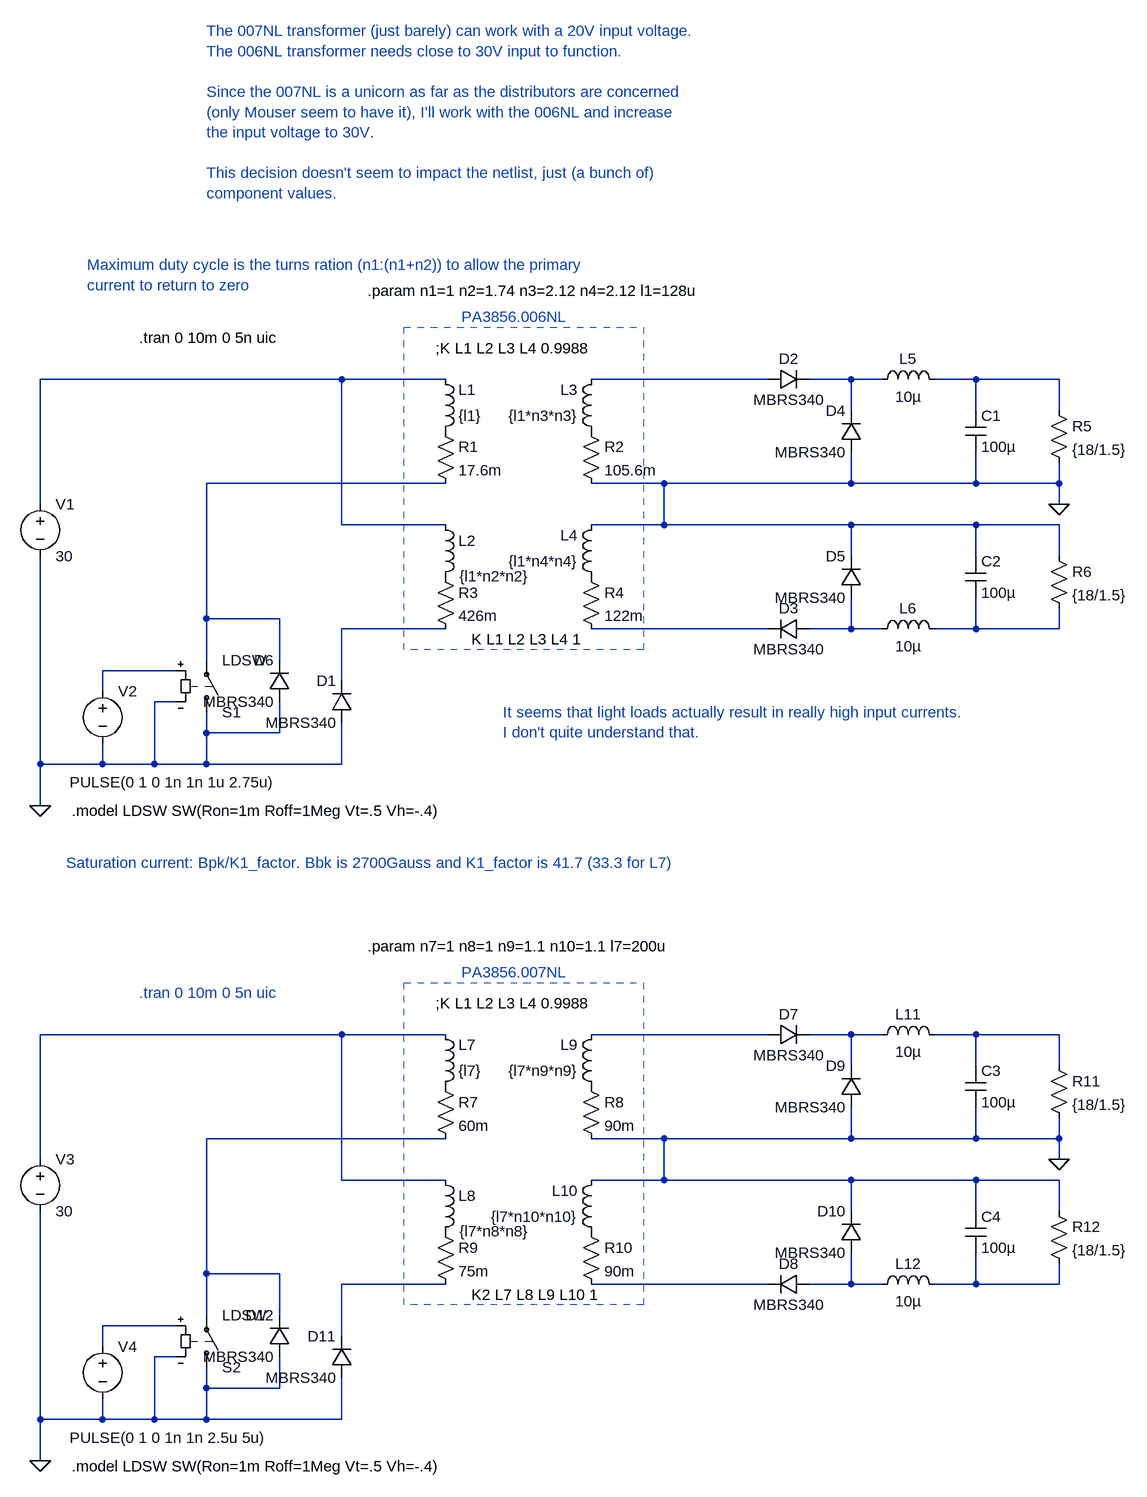
[diagram p0: schematic forward_regulator_test1.asc]
forward_regulator_test1.asc, the LTspice schematic file:
Version 4.1
SHEET 1 1368 2500
WIRE -16 96 -480 96
WIRE 144 96 -16 96
WIRE 640 96 368 96
WIRE 768 96 704 96
WIRE 816 96 768 96
WIRE 960 96 896 96
WIRE 1088 96 960 96
WIRE 768 144 768 96
WIRE 960 144 960 96
WIRE 1088 144 1088 96
WIRE 144 256 -224 256
WIRE 480 256 368 256
WIRE 768 256 768 208
WIRE 768 256 480 256
WIRE 960 256 960 208
WIRE 960 256 768 256
WIRE 1088 256 1088 224
WIRE 1088 256 960 256
WIRE -480 288 -480 96
WIRE 1088 288 1088 256
WIRE -16 320 -16 96
WIRE 144 320 -16 320
WIRE 480 320 480 256
WIRE 480 320 368 320
WIRE 768 320 480 320
WIRE 960 320 768 320
WIRE 1088 320 960 320
WIRE 768 368 768 320
WIRE 960 368 960 320
WIRE 1088 368 1088 320
WIRE -224 464 -224 256
WIRE -112 464 -224 464
WIRE 144 480 -16 480
WIRE 640 480 368 480
WIRE 768 480 768 432
WIRE 768 480 704 480
WIRE 816 480 768 480
WIRE 960 480 960 432
WIRE 960 480 896 480
WIRE 1088 480 1088 448
WIRE 1088 480 960 480
WIRE -224 528 -224 464
WIRE -112 528 -112 464
WIRE -272 544 -384 544
WIRE -16 560 -16 480
WIRE -384 576 -384 544
WIRE -272 592 -304 592
WIRE -224 640 -224 608
WIRE -112 640 -112 592
WIRE -112 640 -224 640
WIRE -480 688 -480 368
WIRE -384 688 -384 656
WIRE -384 688 -480 688
WIRE -304 688 -304 592
WIRE -304 688 -384 688
WIRE -224 688 -224 640
WIRE -224 688 -304 688
WIRE -16 688 -16 624
WIRE -16 688 -224 688
WIRE -480 752 -480 688
WIRE -16 1104 -480 1104
WIRE 144 1104 -16 1104
WIRE 640 1104 368 1104
WIRE 768 1104 704 1104
WIRE 816 1104 768 1104
WIRE 960 1104 896 1104
WIRE 1088 1104 960 1104
WIRE 768 1152 768 1104
WIRE 960 1152 960 1104
WIRE 1088 1152 1088 1104
WIRE 144 1264 -224 1264
WIRE 480 1264 368 1264
WIRE 768 1264 768 1216
WIRE 768 1264 480 1264
WIRE 960 1264 960 1216
WIRE 960 1264 768 1264
WIRE 1088 1264 1088 1232
WIRE 1088 1264 960 1264
WIRE -480 1296 -480 1104
WIRE 1088 1296 1088 1264
WIRE -16 1328 -16 1104
WIRE 144 1328 -16 1328
WIRE 480 1328 480 1264
WIRE 480 1328 368 1328
WIRE 768 1328 480 1328
WIRE 960 1328 768 1328
WIRE 1088 1328 960 1328
WIRE 768 1376 768 1328
WIRE 960 1376 960 1328
WIRE 1088 1376 1088 1328
WIRE -224 1472 -224 1264
WIRE -112 1472 -224 1472
WIRE 144 1488 -16 1488
WIRE 640 1488 368 1488
WIRE 768 1488 768 1440
WIRE 768 1488 704 1488
WIRE 816 1488 768 1488
WIRE 960 1488 960 1440
WIRE 960 1488 896 1488
WIRE 1088 1488 1088 1456
WIRE 1088 1488 960 1488
WIRE -224 1536 -224 1472
WIRE -112 1536 -112 1472
WIRE -272 1552 -384 1552
WIRE -16 1568 -16 1488
WIRE -384 1584 -384 1552
WIRE -272 1600 -304 1600
WIRE -224 1648 -224 1616
WIRE -112 1648 -112 1600
WIRE -112 1648 -224 1648
WIRE -480 1696 -480 1376
WIRE -384 1696 -384 1664
WIRE -384 1696 -480 1696
WIRE -304 1696 -304 1600
WIRE -304 1696 -384 1696
WIRE -224 1696 -224 1648
WIRE -224 1696 -304 1696
WIRE -16 1696 -16 1632
WIRE -16 1696 -224 1696
WIRE -480 1760 -480 1696
FLAG -480 752 0
FLAG 1088 288 0
FLAG -480 1760 0
FLAG 1088 1296 0
SYMBOL ind 128 192 M180
WINDOW 0 36 80 Left 2
WINDOW 3 36 40 Left 2
SYMATTR InstName L1
SYMATTR Value {l1}
SYMATTR Type ind
SYMATTR SpiceLine Rser=1m
SYMBOL ind 128 304 R0
WINDOW 3 37 95 Left 2
SYMATTR InstName L2
SYMATTR Value {l1*n2*n2}
SYMATTR Type ind
SYMATTR SpiceLine Rser=1m
SYMBOL ind 384 192 R180
WINDOW 0 36 80 Left 2
WINDOW 3 36 40 Left 2
SYMATTR InstName L3
SYMATTR Value {l1*n3*n3}
SYMATTR Type ind
SYMATTR SpiceLine Rser=1m
SYMBOL ind 384 416 R180
WINDOW 0 36 80 Left 2
WINDOW 3 36 40 Left 2
SYMATTR InstName L4
SYMATTR Value {l1*n4*n4}
SYMATTR Type ind
SYMATTR SpiceLine Rser=1m
SYMBOL res 128 160 R0
SYMATTR InstName R1
SYMATTR Value 17.6m
SYMBOL res 352 160 R0
SYMATTR InstName R2
SYMATTR Value 105.6m
SYMBOL res 128 384 R0
SYMATTR InstName R3
SYMATTR Value 426m
SYMBOL res 352 384 R0
SYMATTR InstName R4
SYMATTR Value 122m
SYMBOL voltage -480 272 R0
SYMATTR InstName V1
SYMATTR Value 30
SYMBOL sw -224 624 M180
SYMATTR InstName S1
SYMATTR Value LDSW
SYMBOL diode 640 112 R270
WINDOW 0 32 32 VTop 2
WINDOW 3 0 32 VBottom 2
SYMATTR InstName D2
SYMATTR Value MBRS340
SYMBOL ind 800 112 R270
WINDOW 0 32 56 VTop 2
WINDOW 3 5 56 VBottom 2
SYMATTR InstName L5
SYMATTR Value 10µ
SYMBOL cap 944 144 R0
SYMATTR InstName C1
SYMATTR Value 100µ
SYMBOL res 1072 128 R0
SYMATTR InstName R5
SYMATTR Value {18/1.5}
SYMBOL ind 800 496 R270
WINDOW 0 32 56 VTop 2
WINDOW 3 5 56 VBottom 2
SYMATTR InstName L6
SYMATTR Value 10µ
SYMBOL cap 944 368 R0
SYMATTR InstName C2
SYMATTR Value 100µ
SYMBOL res 1072 352 R0
SYMATTR InstName R6
SYMATTR Value {18/1.5}
SYMBOL diode 704 464 R90
WINDOW 0 0 32 VBottom 2
WINDOW 3 32 32 VTop 2
SYMATTR InstName D3
SYMATTR Value MBRS340
SYMBOL diode 784 208 R180
WINDOW 0 24 64 Left 2
WINDOW 3 24 0 Left 2
SYMATTR InstName D4
SYMATTR Value MBRS340
SYMBOL diode 784 432 R180
WINDOW 0 24 64 Left 2
WINDOW 3 24 0 Left 2
SYMATTR InstName D5
SYMATTR Value MBRS340
SYMBOL diode 0 624 R180
WINDOW 0 24 64 Left 2
WINDOW 3 24 0 Left 2
SYMATTR InstName D1
SYMATTR Value MBRS340
SYMBOL voltage -384 560 R0
WINDOW 3 -51 156 Left 2
WINDOW 123 0 0 Left 0
WINDOW 39 0 0 Left 0
SYMATTR Value PULSE(0 1 0 1n 1n 1u 2.75u)
SYMATTR InstName V2
SYMBOL diode -96 592 R180
WINDOW 0 24 64 Left 2
WINDOW 3 24 0 Left 2
SYMATTR InstName D6
SYMATTR Value MBRS340
SYMBOL ind 128 1200 M180
WINDOW 0 36 80 Left 2
WINDOW 3 36 40 Left 2
SYMATTR InstName L7
SYMATTR Value {l7}
SYMATTR Type ind
SYMATTR SpiceLine Rser=1m
SYMBOL ind 128 1312 R0
WINDOW 3 37 95 Left 2
SYMATTR InstName L8
SYMATTR Value {l7*n8*n8}
SYMATTR Type ind
SYMATTR SpiceLine Rser=1m
SYMBOL ind 384 1200 R180
WINDOW 0 36 80 Left 2
WINDOW 3 36 40 Left 2
SYMATTR InstName L9
SYMATTR Value {l7*n9*n9}
SYMATTR Type ind
SYMATTR SpiceLine Rser=1m
SYMBOL ind 384 1424 R180
WINDOW 0 36 80 Left 2
WINDOW 3 36 40 Left 2
SYMATTR InstName L10
SYMATTR Value {l7*n10*n10}
SYMATTR Type ind
SYMATTR SpiceLine Rser=1m
SYMBOL res 128 1168 R0
SYMATTR InstName R7
SYMATTR Value 60m
SYMBOL res 352 1168 R0
SYMATTR InstName R8
SYMATTR Value 90m
SYMBOL res 128 1392 R0
SYMATTR InstName R9
SYMATTR Value 75m
SYMBOL res 352 1392 R0
SYMATTR InstName R10
SYMATTR Value 90m
SYMBOL voltage -480 1280 R0
SYMATTR InstName V3
SYMATTR Value 30
SYMBOL sw -224 1632 M180
SYMATTR InstName S2
SYMATTR Value LDSW
SYMBOL diode 640 1120 R270
WINDOW 0 32 32 VTop 2
WINDOW 3 0 32 VBottom 2
SYMATTR InstName D7
SYMATTR Value MBRS340
SYMBOL ind 800 1120 R270
WINDOW 0 32 56 VTop 2
WINDOW 3 5 56 VBottom 2
SYMATTR InstName L11
SYMATTR Value 10µ
SYMBOL cap 944 1152 R0
SYMATTR InstName C3
SYMATTR Value 100µ
SYMBOL res 1072 1136 R0
SYMATTR InstName R11
SYMATTR Value {18/1.5}
SYMBOL ind 800 1504 R270
WINDOW 0 32 56 VTop 2
WINDOW 3 5 56 VBottom 2
SYMATTR InstName L12
SYMATTR Value 10µ
SYMBOL cap 944 1376 R0
SYMATTR InstName C4
SYMATTR Value 100µ
SYMBOL res 1072 1360 R0
SYMATTR InstName R12
SYMATTR Value {18/1.5}
SYMBOL diode 704 1472 R90
WINDOW 0 0 32 VBottom 2
WINDOW 3 32 32 VTop 2
SYMATTR InstName D8
SYMATTR Value MBRS340
SYMBOL diode 784 1216 R180
WINDOW 0 24 64 Left 2
WINDOW 3 24 0 Left 2
SYMATTR InstName D9
SYMATTR Value MBRS340
SYMBOL diode 784 1440 R180
WINDOW 0 24 64 Left 2
WINDOW 3 24 0 Left 2
SYMATTR InstName D10
SYMATTR Value MBRS340
SYMBOL diode 0 1632 R180
WINDOW 0 24 64 Left 2
WINDOW 3 24 0 Left 2
SYMATTR InstName D11
SYMATTR Value MBRS340
SYMBOL voltage -384 1568 R0
WINDOW 3 -51 156 Left 2
WINDOW 123 0 0 Left 0
WINDOW 39 0 0 Left 0
SYMATTR Value PULSE(0 1 0 1n 1n 2.5u 5u)
SYMATTR InstName V4
SYMBOL diode -96 1600 R180
WINDOW 0 24 64 Left 2
WINDOW 3 24 0 Left 2
SYMATTR InstName D12
SYMATTR Value MBRS340
TEXT 128 48 Left 2 !;K L1 L2 L3 L4 0.9988
TEXT 168 0 Left 2 ;PA3856.006NL
TEXT -432 760 Left 2 !.model LDSW SW(Ron=1m Roff=1Meg Vt=.5 Vh=-.4)
TEXT -328 32 Left 2 !.tran 0 10m 0 5n uic
TEXT 184 496 Left 2 !K L1 L2 L3 L4 1
TEXT 24 -40 Left 2 !.param n1=1 n2=1.74 n3=2.12 n4=2.12 l1=128u
TEXT -408 -80 Left 2 ;Maximum duty cycle is the turns ration (n1:(n1+n2)) to allow the primary\ncurrent to return to zero
TEXT 128 1056 Left 2 !;K L1 L2 L3 L4 0.9988
TEXT 168 1008 Left 2 ;PA3856.007NL
TEXT -432 1768 Left 2 !.model LDSW SW(Ron=1m Roff=1Meg Vt=.5 Vh=-.4)
TEXT -328 1040 Left 2 ;.tran 0 10m 0 5n uic
TEXT 184 1504 Left 2 !K2 L7 L8 L9 L10 1
TEXT 24 968 Left 2 !.param n7=1 n8=1 n9=1.1 n10=1.1 l7=200u
TEXT -440 840 Left 2 ;Saturation current: Bpk/K1_factor. Bbk is 2700Gauss and K1_factor is 41.7 (33.3 for L7)
TEXT -224 -440 Left 2 ;The 007NL transformer (just barely) can work with a 20V input voltage.\nThe 006NL transformer needs close to 30V input to function.\n \nSince the 007NL is a unicorn as far as the distributors are concerned\n(only Mouser seem to have it), I'll work with the 006NL and increase\nthe input voltage to 30V.\n \nThis decision doesn't seem to impact the netlist, just (a bunch of)\ncomponent values.
TEXT 232 608 Left 2 ;It seems that light loads actually result in really high input currents.\nI don't quite understand that.
RECTANGLE Normal 448 512 80 16 2
RECTANGLE Normal 448 1520 80 1024 2

The netlist it stands for:
* forward_regulator_test1.asc
L1 P001 N001 {l1} Rser=1m
L2 N001 P002 {l1*n2*n2} Rser=1m
L3 P003 N002 {l1*n3*n3} Rser=1m
L4 P004 0 {l1*n4*n4} Rser=1m
R1 P001 N005 17.6m
R2 P003 0 105.6m
R3 P002 N006 426m
R4 P004 N007 122m
V1 N001 0 30
S1 0 N005 N010 0 LDSW
D2 N002 N003 MBRS340
L5 N003 N004 10µ
C1 N004 0 100µ
R5 N004 0 {18/1.5}
L6 N008 N009 10µ
C2 0 N009 100µ
R6 0 N009 {18/1.5}
D3 N008 N007 MBRS340
D4 0 N003 MBRS340
D5 N008 0 MBRS340
D1 0 N006 MBRS340
V2 N010 0 PULSE(0 1 0 1n 1n 1u 2.75u)
D6 0 N005 MBRS340
L7 P005 N011 {l7} Rser=1m
L8 N011 P006 {l7*n8*n8} Rser=1m
L9 P007 N012 {l7*n9*n9} Rser=1m
L10 P008 0 {l7*n10*n10} Rser=1m
R7 P005 N015 60m
R8 P007 0 90m
R9 P006 N016 75m
R10 P008 N017 90m
V3 N011 0 30
S2 0 N015 N020 0 LDSW
D7 N012 N013 MBRS340
L11 N013 N014 10µ
C3 N014 0 100µ
R11 N014 0 {18/1.5}
L12 N018 N019 10µ
C4 0 N019 100µ
R12 0 N019 {18/1.5}
D8 N018 N017 MBRS340
D9 0 N013 MBRS340
D10 N018 0 MBRS340
D11 0 N016 MBRS340
V4 N020 0 PULSE(0 1 0 1n 1n 2.5u 5u)
D12 0 N015 MBRS340
.model D D
.lib standard.dio
;K L1 L2 L3 L4 0.9988
* PA3856.006NL
.model LDSW SW(Ron=1m Roff=1Meg Vt=.5 Vh=-.4)
.tran 0 10m 0 5n uic
K L1 L2 L3 L4 1
.param n1=1 n2=1.74 n3=2.12 n4=2.12 l1=128u
* Maximum duty cycle is the turns ration (n1:(n1+n2)) to allow the primary
* current to return to zero
;K L1 L2 L3 L4 0.9988
* PA3856.007NL
.model LDSW SW(Ron=1m Roff=1Meg Vt=.5 Vh=-.4)
* .tran 0 10m 0 5n uic
K2 L7 L8 L9 L10 1
.param n7=1 n8=1 n9=1.1 n10=1.1 l7=200u
* Saturation current: Bpk/K1_factor. Bbk is 2700Gauss and K1_factor is 41.7 (33.3 for L7)
* The 007NL transformer (just barely) can work with a 20V input voltage.
* The 006NL transformer needs close to 30V input to function.
* Since the 007NL is a unicorn as far as the distributors are concerned
* (only Mouser seem to have it), I'll work with the 006NL and increase
* the input voltage to 30V.
* This decision doesn't seem to impact the netlist, just (a bunch of)
* component values.
* It seems that light loads actually result in really high input currents.
* I don't quite understand that.
.backanno
.end